# EAGLE design TivaLCD (EAGLE 6.6.0)
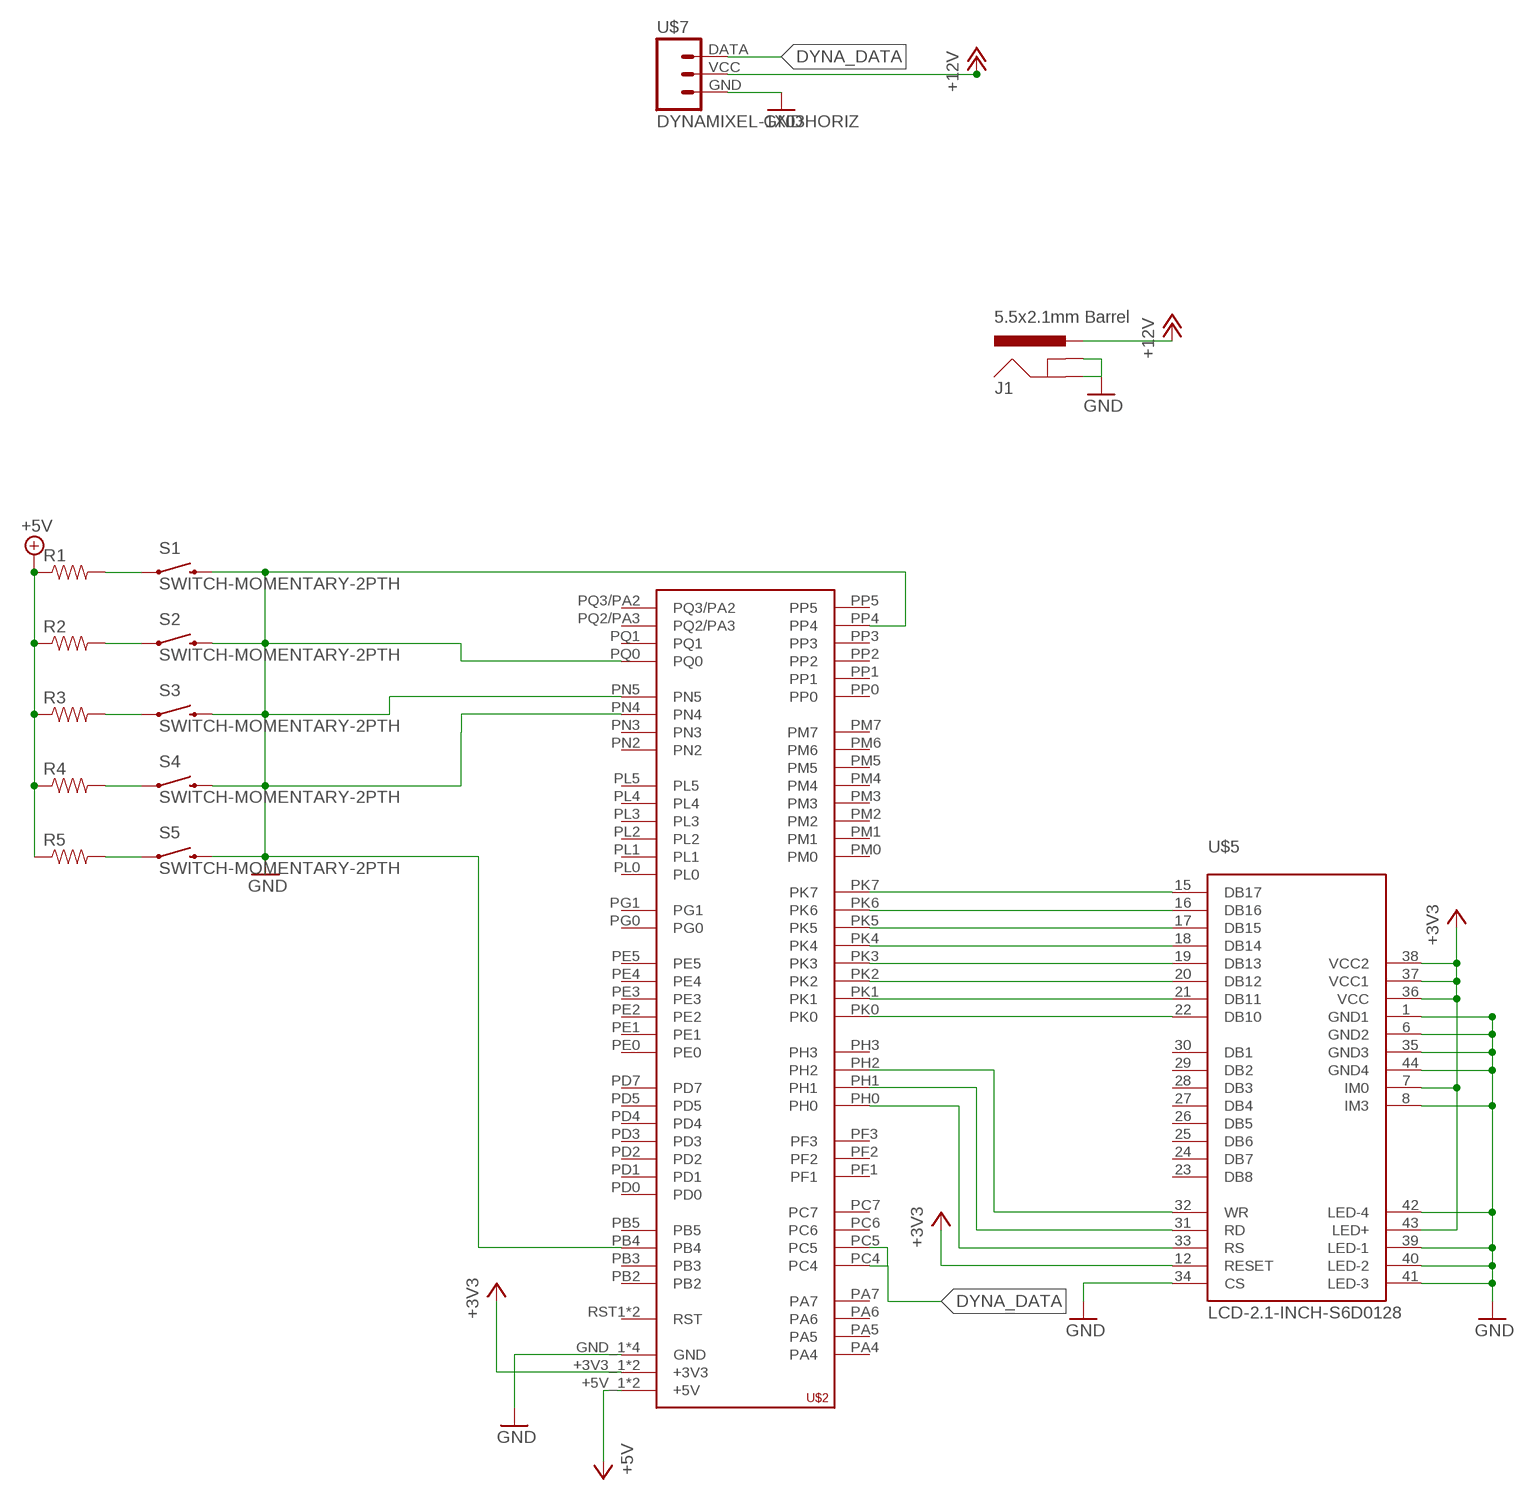
[diagram p0: schematic, sheet 1]

## Parts
J1  5.5x2.1mm Barrel  POWER_JACKSMD  [POWER_JACK_SMD]
R1  RESISTOR1206  [1206]
R2  RESISTOR1206  [1206]
R3  RESISTOR1206  [1206]
R4  RESISTOR1206  [1206]
R5  RESISTOR1206  [1206]
S1  SWITCH-MOMENTARY-2PTH  [TACTILE-PTH]
S2  SWITCH-MOMENTARY-2PTH  [TACTILE-PTH]
S3  SWITCH-MOMENTARY-2PTH  [TACTILE-PTH]
S4  SWITCH-MOMENTARY-2PTH  [TACTILE-PTH]
S5  SWITCH-MOMENTARY-2PTH  [TACTILE-PTH]
U$2  TIVA-C-CONNECTED  [TIVA-C-CONNECTED]
U$5  LCD-2.1-INCH-S6D0128  [LCD-2.1-44PIN-0.8]
U$7  DYNAMIXEL-1X03HORIZ  [MLX-SPOX5268-3PIN]

## Nets
+3V3: U$2.+3V3_1(+3V3) U$2.+3V3_2(+3V3) U$5.7(IM0) U$5.12(RESET) U$5.36(VCC) U$5.37(VCC1) U$5.38(VCC2) U$5.43(LED+)
+5V: R1.1 R2.1 R3.1 R4.1 R5.1 U$2.+5V_1(+5V) U$2.+5V_2(+5V)
+12V: J1.VIN0(PWR) U$7.VCC
DYNA_DATA: U$2.PC4 U$2.PC5 U$7.DATA
GND: J1.GND(GNDBREAK) J1.P$4(GND) S1.3 S2.3 S3.3 S4.3 S5.3 U$2.GND_1(GND) U$2.GND_2(GND) U$2.GND_3(GND) U$2.GND_4(GND) U$2.PB4 U$2.PN5 U$2.PP4 U$2.PQ0 U$5.1(GND1) U$5.6(GND2) U$5.8(IM3) U$5.34(CS) U$5.35(GND3) U$5.39(LED-1) U$5.40(LED-2) U$5.41(LED-3) U$5.42(LED-4) U$5.44(GND4) U$7.GND
N$1: U$2.PK0 U$5.22(DB10)
N$2: U$2.PK1 U$5.21(DB11)
N$3: U$2.PK2 U$5.20(DB12)
N$4: U$2.PK3 U$5.19(DB13)
N$5: U$2.PK4 U$5.18(DB14)
N$6: U$2.PK5 U$5.17(DB15)
N$7: U$2.PK6 U$5.16(DB16)
N$8: U$2.PK7 U$5.15(DB17)
N$9: U$2.PH0 U$5.33(RS)
N$10: U$2.PH1 U$5.31(RD)
N$11: U$2.PH2 U$5.32(WR)
N$13: R1.2 S1.1
N$14: R2.2 S2.1
N$15: R3.2 S3.1
N$16: R4.2 S4.1
N$17: R5.2 S5.1
N$21: U$2.PN4
Unconnected: U$2.PA4 U$2.PA5 U$2.PA6 U$2.PA7 U$2.PB2 U$2.PB3 U$2.PB5 U$2.PC6 U$2.PC7 U$2.PD0 U$2.PD1 U$2.PD2 U$2.PD3 U$2.PD4 U$2.PD5 U$2.PD7 U$2.PE0 U$2.PE1 U$2.PE2 U$2.PE3 U$2.PE4 U$2.PE5 U$2.PF1 U$2.PF2 U$2.PF3 U$2.PG0 U$2.PG1 U$2.PH3 U$2.PL0 U$2.PL1 U$2.PL2 U$2.PL3 U$2.PL4 U$2.PL5 U$2.PM0 U$2.PM1 U$2.PM2 U$2.PM3 U$2.PM4 U$2.PM5 U$2.PM6 U$2.PM7 U$2.PN2 U$2.PN3 U$2.PP0 U$2.PP1 U$2.PP2 U$2.PP3 U$2.PP5 U$2.PQ1 U$2.PQ2/PA3 U$2.PQ3/PA2 U$2.RST1(RST) U$2.RST_2(RST) U$5.23(DB8) U$5.24(DB7) U$5.25(DB6) U$5.26(DB5) U$5.27(DB4) U$5.28(DB3) U$5.29(DB2) U$5.30(DB1)

## Library data of the parts
J1 = SparkFun-Connectors:POWER_JACK: Power Jack This is the standard 5.5mm barrel jack for power. The PTH is the most common, proven, reliable, footprint. The Slot footprint only works if the mill layer is transmitted to the PCB fab house so be warned. Mating wall wart : TOL-00298 (and others); PROD_ID: CONN-08106; SF_ID: PRT-12748
R1-R4 = SparkFun-Passives:RESISTOR: Resistor Basic schematic elements and footprints for 0603, 1206, and PTH resistors.
R5 = SparkFun-Resistors:RESISTOR: Resistor Basic schematic elements and footprints for 0603, 1206, and PTH resistors.
S1-S5 = SparkFun-Electromechanical:SWITCH-MOMENTARY-2: Various NO switches- pushbuttons, reed, etc; PROD_ID: SWCH-08441
U$2 = MRDT-2015-General:TIVA-C-CONNECTED: TIVA C CONNECTED LAUNCHPAD
U$5 = LCD:LCD-2.1-INCH-S6D0128: For use with coldtears electronics 2.1INCH S6D0128 176x220
U$7 = MRDT-2015-Arm:DYNAMIXEL-1X03; MFR: Molex; MFR_PN: 0022057035; ORIENT: Horiz

## Board
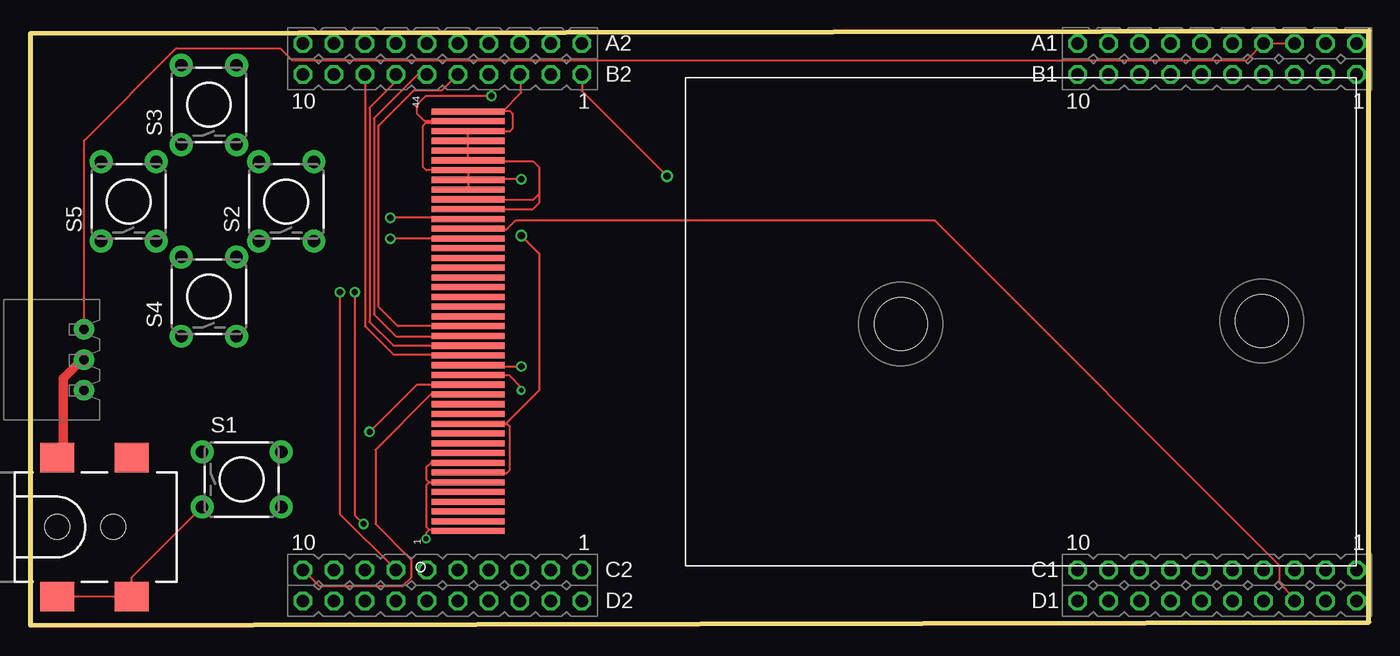
[diagram p1: board, top side]
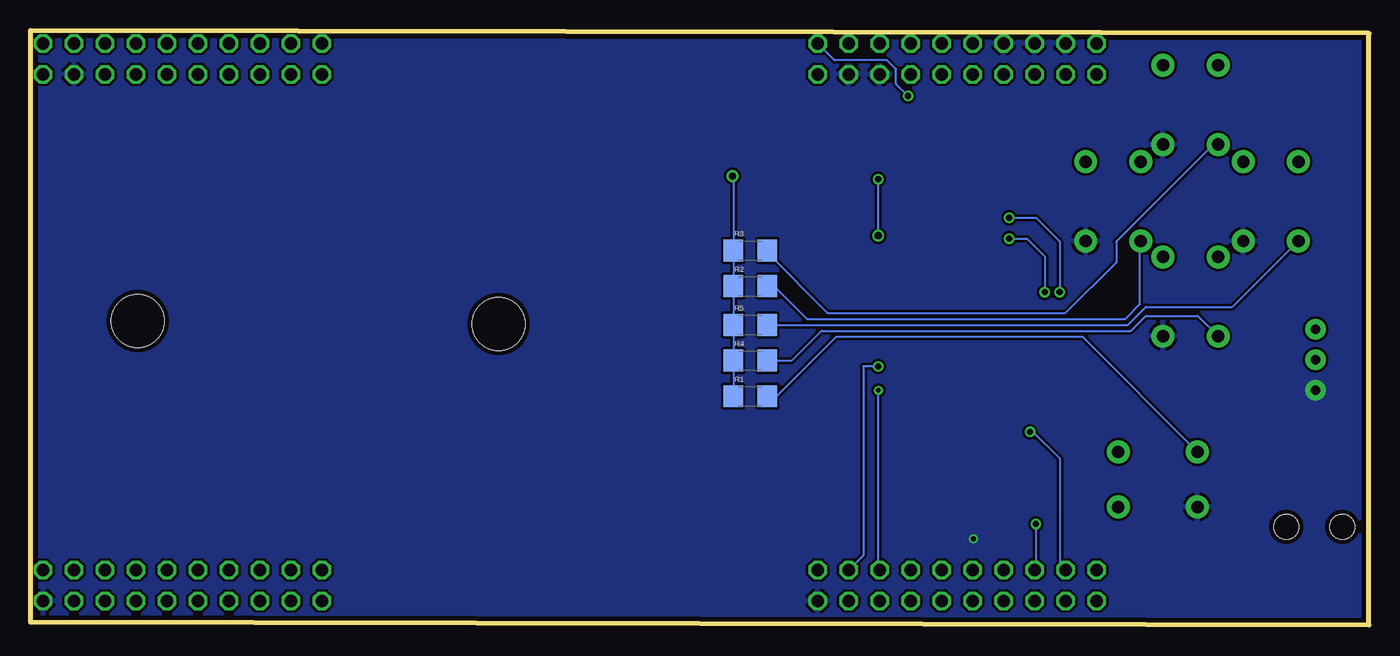
[diagram p2: board, bottom side, seen from below]

Size 109.73 x 48.77 mm. Coordinates in mm from the lower left corner, seen from the top.
Outline: 0,0 109.73,0.24 109.73,48.77 0,48.52 0,0
Copper layers (1*16): Top 0.0356mm / dielectric 1.5011mm / Bottom 0.0356mm
Design rules "LaenPCBOrder *": minimum track width 6mil, minimum drill 15mil, track to track 8mil, track to pad 8mil, pad to pad 8mil, via to via 8mil, smd to smd 6mil, copper to edge 15mil, drill to drill 6mil, minimum pad ring 7mil, minimum via ring 7mil, stop-mask expansion 3mil, vias tented up to drill 0mil, thermal gap 10mil

### Footprints (pad centres in the part's own frame; a part is rotated, then mirrored left to right if it is on the bottom)
POWER_JACK_SMD = smd 2.8 x 2.4: GND 0,-5.7; P$4 6.1,-5.7; VIN0 0,5.7; VIN1 6.1,5.7 | hole 2.032: 0,0; 4.572,0
1206 = smd 1.6 x 1.8: 1 -1.4,0; 2 1.4,0
TACTILE-PTH = drill 1.016 pad 1.88: 1 -3.251,2.261; 2 3.251,2.261; 3 -3.251,-2.261; 4 3.251,-2.261
TIVA-C-CONNECTED = drill 1.016 octagon: +3V3_1 59.69,54.61; +3V3_2 123.19,54.61; +5V_1 59.69,52.07; +5V_2 123.19,52.07; GND_1 57.15,52.07; GND_2 59.69,8.89; GND_3 120.65,52.07; GND_4 123.19,8.89; PA4 39.37,52.07; PA5 36.83,52.07; PA6 105.41,52.07; PA7 52.07,8.89; PB2 102.87,54.61; PB3 100.33,54.61; PB4 54.61,52.07; PB5 52.07,52.07; PC4 118.11,54.61; PC5 115.57,54.61; PC6 113.03,54.61; PC7 105.41,54.61; PD0 107.95,8.89; PD1 110.49,8.89; PD2 57.15,54.61; PD3 107.95,54.61; PD4 49.53,54.61; PD5 46.99,54.61; PD7 107.95,52.07; PE0 118.11,52.07; PE1 115.57,52.07; PE2 113.03,52.07; PE3 110.49,52.07; PE4 120.65,54.61; PE5 110.49,54.61; PF1 123.19,11.43; PF2 120.65,11.43; PF3 118.11,11.43; PG0 115.57,11.43; PG1 59.69,11.43; PH0 44.45,11.43; PH1 41.91,11.43; PH2 118.11,8.89; PH3 115.57,8.89; PK0 49.53,52.07; PK1 46.99,52.07; PK2 44.45,52.07; PK3 41.91,52.07; PK4 57.15,11.43; PK5 54.61,11.43; PK6 39.37,11.43; PK7 36.83,11.43; PL0 107.95,11.43; PL1 105.41,11.43; PL2 102.87,11.43; PL3 100.33,11.43; PL4 113.03,11.43; PL5 110.49,11.43; PM0 52.07,11.43; PM1 49.53,11.43; PM2 46.99,11.43; PM3 120.65,8.89; PM4 102.87,52.07; PM5 100.33,52.07; PM6 36.83,8.89; PM7 57.15,8.89; PN2 105.41,8.89; PN3 102.87,8.89; PN4 36.83,54.61; PN5 39.37,54.61; PP0 54.61,54.61; PP1 52.07,54.61; PP2 100.33,8.89; PP3 41.91,8.89; PP4 41.91,54.61; PP5 54.61,8.89; PQ0 44.45,54.61; PQ1 39.37,8.89; PQ2/PA3 46.99,8.89; PQ3/PA2 44.45,8.89; RST1 49.53,8.89; RST_2 113.03,8.89
#8_SCREW = hole 4.318: 0,0
LCD-2.1-44PIN-0.8 = smd 0.5 x 6: 1 -2.84,5.17; 2 -3.64,5.17; 3 -4.44,5.17; 4 -5.24,5.17; 5 -6.04,5.17; 6 -6.84,5.17; 7 -7.64,5.17; 8 -8.44,5.17; 9 -9.24,5.17; 10 -10.04,5.17; 11 -10.84,5.17; 12 -11.64,5.17; 13 -12.44,5.17; 14 -13.24,5.17; 15 -14.04,5.17; 16 -14.84,5.17; 17 -15.64,5.17; 18 -16.44,5.17; 19 -17.24,5.17; 20 -18.04,5.17; 21 -18.84,5.17; 22 -19.64,5.17; 23 -20.44,5.17; 24 -21.24,5.17; 25 -22.04,5.17; 26 -22.84,5.17; 27 -23.64,5.17; 28 -24.44,5.17; 29 -25.24,5.17; 30 -26.04,5.17; 31 -26.84,5.17; 32 -27.64,5.17; 33 -28.44,5.17; 34 -29.24,5.17; 35 -30.04,5.17; 36 -30.84,5.17; 37 -31.64,5.17; 38 -32.44,5.17; 39 -33.24,5.17; 40 -34.04,5.17; 41 -34.84,5.17; 42 -35.64,5.17; 43 -36.44,5.17; 44 -37.24,5.17
MLX-SPOX5268-3PIN = drill 0.8 pad 1.676: DATA 5,0; GND 0,0; VCC 2.5,0

### Placement (x,y rotation side)
J1  2.19,8.05 0 top
R1  50.72,18.78 0 bottom
R2  50.72,27.8 0 bottom
R3  50.72,30.72 0 bottom
R4  50.72,21.7 0 bottom
R5  50.72,24.63 0 bottom
S1  17.31,11.95 0 top
S2  20.97,34.75 90 top
S3  14.63,42.67 90 top
S4  14.63,26.94 90 top
S5  8.05,34.75 90 top
U$2  -14.49,-6.9 0 top
U$3  [#8_SCREW]  100.95,24.94 0 top
U$4  [#8_SCREW]  71.34,24.7 0 top
U$5  30.69,4.88 270 top
U$7  4.39,19.26 90 top

### Tracks (layer width: path | path; a pad name or v marks a point on that pad's centre or on a via)
+3V3  (via drill 0.5 pad 0.41, 0.6 pad 0.41)
  Top 0.152: U$5.7 35.94,12.44 39.01,12.44 39.26,12.68 39.26,16.34 39.08,16.52 U$5.12 35.86,16.56 35.84,16.58 39.01,16.58 41.7,19.26 41.7,30.48 v40.23,31.94 | v40.23,36.58 35.92,36.58 U$5.37 | U$5.37 U$5.38 32.44,37.32 32.43,37.31 32.19,37.55 32.19,40.96 32.43,41.21 35.76,41.21 U$5.43 32.32,41.32 31.7,41.94 31.7,42.67 32.43,43.4 v37.8,43.4 | U$5.37 U$5.36
  Bottom 0.152: v40.23,31.94 v40.23,36.58 | v37.8,43.4 38.77,44.38 38.77,45.6 39.5,46.33 43.82,46.33 U$2.+3V3_1
+5V  (via drill 0.6 pad 0.41)
  Top 0.152: U$2.+5V_1 45.2,43.8 v52.18,36.82
  Bottom 0.152: v52.18,36.82 52.12,36.76 R3.1 | R3.1 | R3.1 R2.1 | R2.1 | R2.1 R5.1 | R5.1 | R5.1 R4.1 | R4.1 | R4.1 R1.1
+12V
  Top 0.152: U$7.VCC 4.21,21.76 | 2.68,14.23 J1.VIN0
  Top 0.762: 4.21,21.76 2.68,20.24 2.68,14.23
DYNA_DATA
  Top 0.152: U$7.DATA 4.39,39.75 11.95,47.3 20.48,47.3 21.46,46.33 99.7,46.33 U$2.PC5 U$2.PC4
GND  (via drill 0.38 pad 0.41)
  Top 0.152: U$2.PB4 40.23,45.06 40.23,43.65 38.7,42.12 U$5.44 35.93,42.18 39.26,42.18 39.5,41.94 39.5,40.72 39.26,40.48 36.82,40.48 36.78,40.52 U$5.42 U$5.41 U$5.40 U$5.39 35.94,38.04 41.21,38.04 41.7,37.55 41.7,35.36 | U$5.35 38.48,34.92 38.53,34.87 41.21,34.87 41.7,35.36 | U$5.34 35.88,34.14 41.21,34.14 41.7,34.62 41.7,35.36 | J1.GND J1.P$4 8.29,3.92 S1.3 | U$5.8 32.82,13.32 32.43,12.92 32.43,11.95 32.67,11.7 35.85,11.7 U$5.6 32.69,11.72 32.43,11.46 32.43,8.05 32.67,7.8 | 33.16,7.8 35.78,7.8 U$5.1 33.25,7.72 33.16,7.8 | 33.16,7.8 32.67,7.8 | 32.67,7.8 32.43,7.56 v32.43,7.07
  pour Bottom: 0,0.24 0,48.77 109.73,48.77 109.73,0.24
N$1
  Top 0.152: U$5.22 30.1,24.52 28.53,26.09 28.53,40.96 31.46,43.89 33.76,43.89 U$2.PK0
N$2
  Top 0.152: U$2.PK1 31.76,45.17 28.29,41.7 | 28.29,41.7 | 28.29,41.7 28.16,41.57 28.16,25.48 29.99,23.65 35.8,23.65 U$5.21
N$3
  Top 0.152: U$2.PK2 29.96,44.59 27.8,42.43 27.8,24.87 29.75,22.92 U$5.20
N$4
  Top 0.152: U$2.PK3 27.42,24.52 29.75,22.19 35.79,22.19 U$5.19
N$5  (via drill 0.5 pad 0.15)
  Top 0.152: U$5.18 37.69,21.32 37.8,21.21 v40.23,21.21
  Bottom 0.152: v40.23,21.21 41.45,21.21 41.45,5.74 U$2.PK4
N$6  (via drill 0.38 pad 0.41)
  Top 0.152: v40.23,19.26 40.23,19.51 39.26,20.48 35.9,20.48 U$5.17
  Bottom 0.152: v40.23,19.26 40.23,4.63 40.22,4.63 U$2.PK5
N$7  (via drill 0.5 pad 0.15)
  Top 0.152: U$5.16 31.67,19.72 v27.8,15.85
  Bottom 0.152: v27.8,15.85 27.55,15.85 25.36,13.65 25.36,5.01 U$2.PK6
N$8
  Top 0.152: U$5.15 32.82,18.92 28.29,14.39 28.29,8.29 31.21,5.36 31.21,3.9 30.48,3.17 23.7,3.17 U$2.PK7
N$9  (via drill 0.5 pad 0.15, 0.5 pad 0.41)
  Top 0.152: U$5.33 34.23,33.32 34.14,33.41 v29.5,33.41 | v25.36,27.31 25.36,9.13 U$2.PH0
  Bottom 0.152: v29.5,33.41 27.31,33.41 25.36,31.45 v25.36,27.31
N$10  (via drill 0.5 pad 0.15)
  Top 0.152: U$5.31 29.52,31.72 v29.5,31.7 | v26.58,27.31 26.58,9.02 v27.31,8.29
  Bottom 0.152: v29.5,31.7 28.04,31.7 26.58,30.24 v26.58,27.31 | v27.31,8.29 27.31,4.64 U$2.PH1
N$11
  Top 0.152: 36.02,32.67 U$5.32 35.95,32.43 39.01,32.43 39.75,33.16 74.13,33.16 102.41,4.88 102.41,3.41 103.62,2.2 U$2.PH2
N$13
  Bottom 0.152: R1.2 48.52,18.78 43.65,23.65 23.51,23.65 S1.1
N$14
  Bottom 0.152: R2.2 48.77,27.8 46.09,25.12 20,25.12 18.78,26.33 18.78,31.43 S2.1
N$15
  Bottom 0.152: R3.2 49.32,30.54 44.38,25.6 24.87,25.6 20.73,29.75 20.73,31.45 12.76,39.42 S3.1
N$16
  Bottom 0.152: R4.2 47.31,21.7 44.87,24.14 19.51,24.14 18.29,25.36 14.04,25.36 S4.1
N$17
  Bottom 0.152: R5.2 19.75,24.63 18.29,26.09 11.19,26.09 S5.1